# Altium schematic sheet ISO-ASS[3]-VB.SchDoc
size 1200 x 400 mm
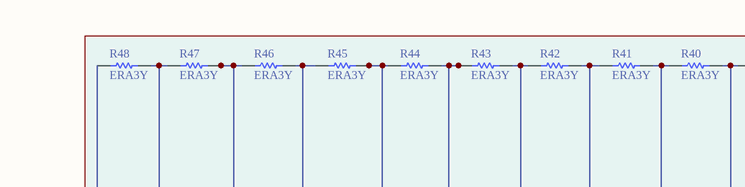
[diagram p0: ISO-ASS[3]-VB.SchDoc, top middle]
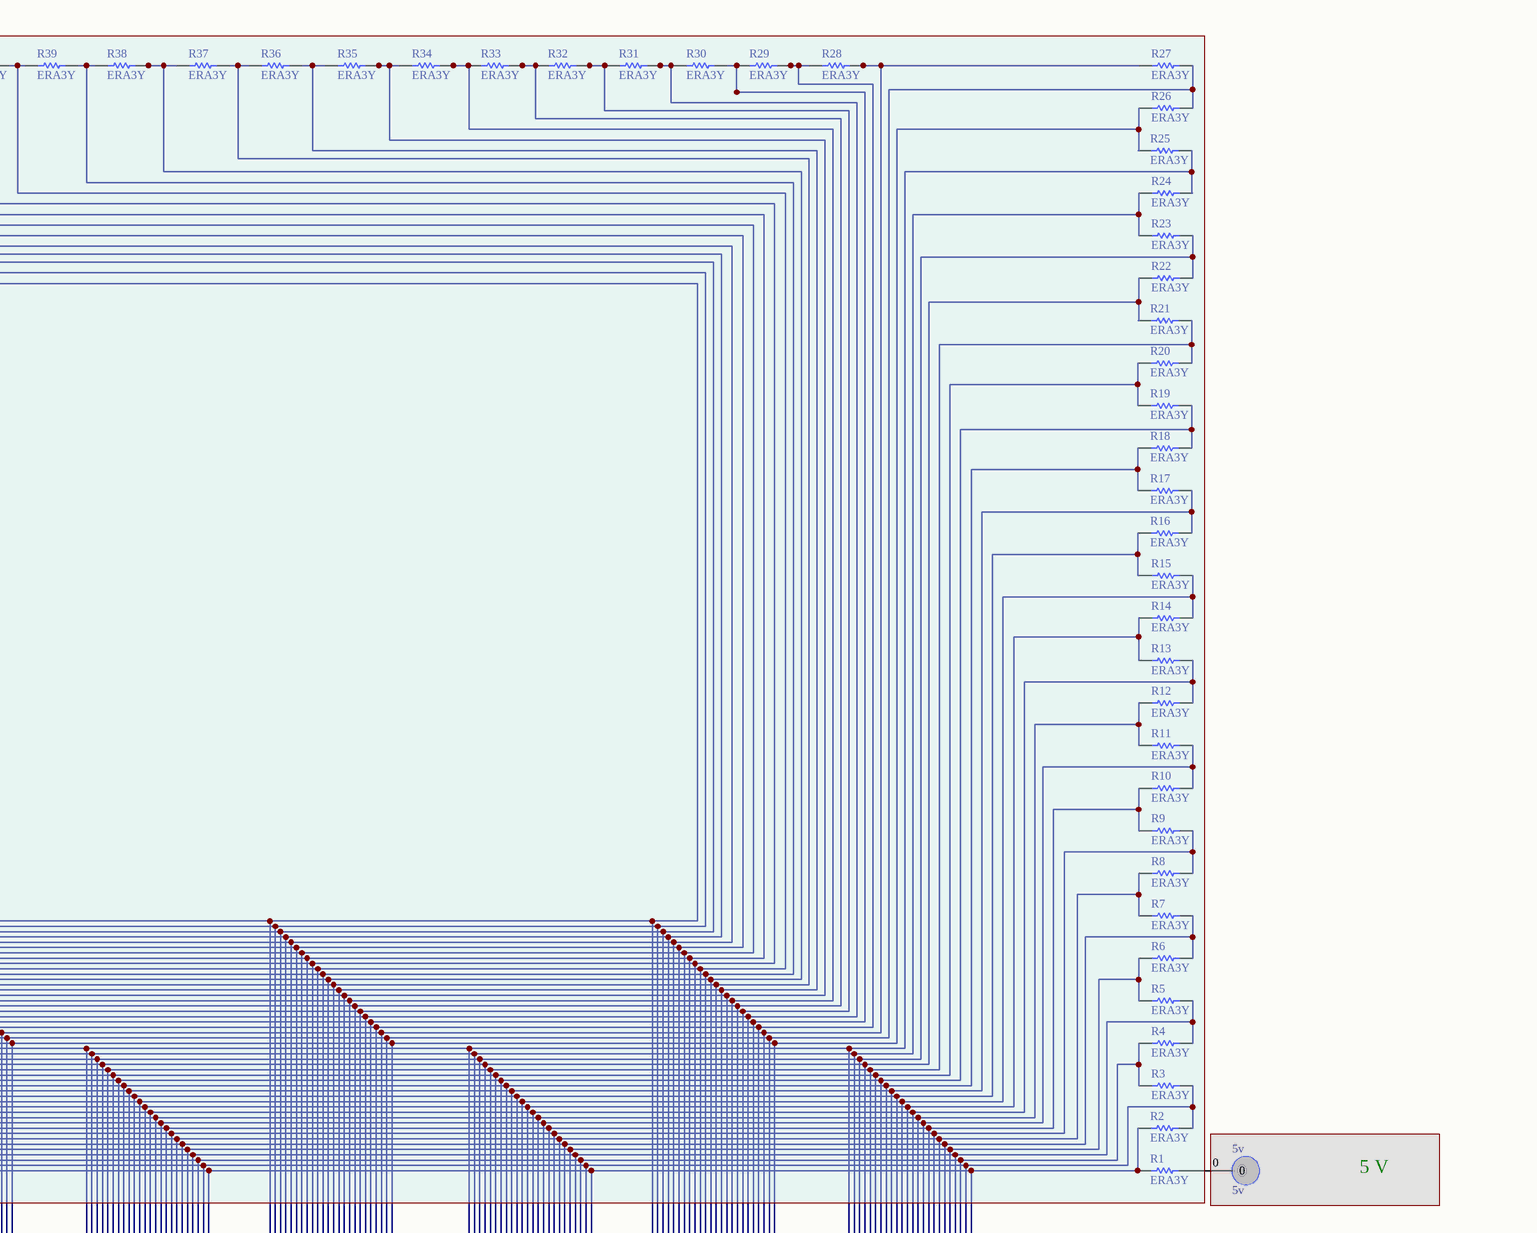
[diagram p1: ISO-ASS[3]-VB.SchDoc, top right]
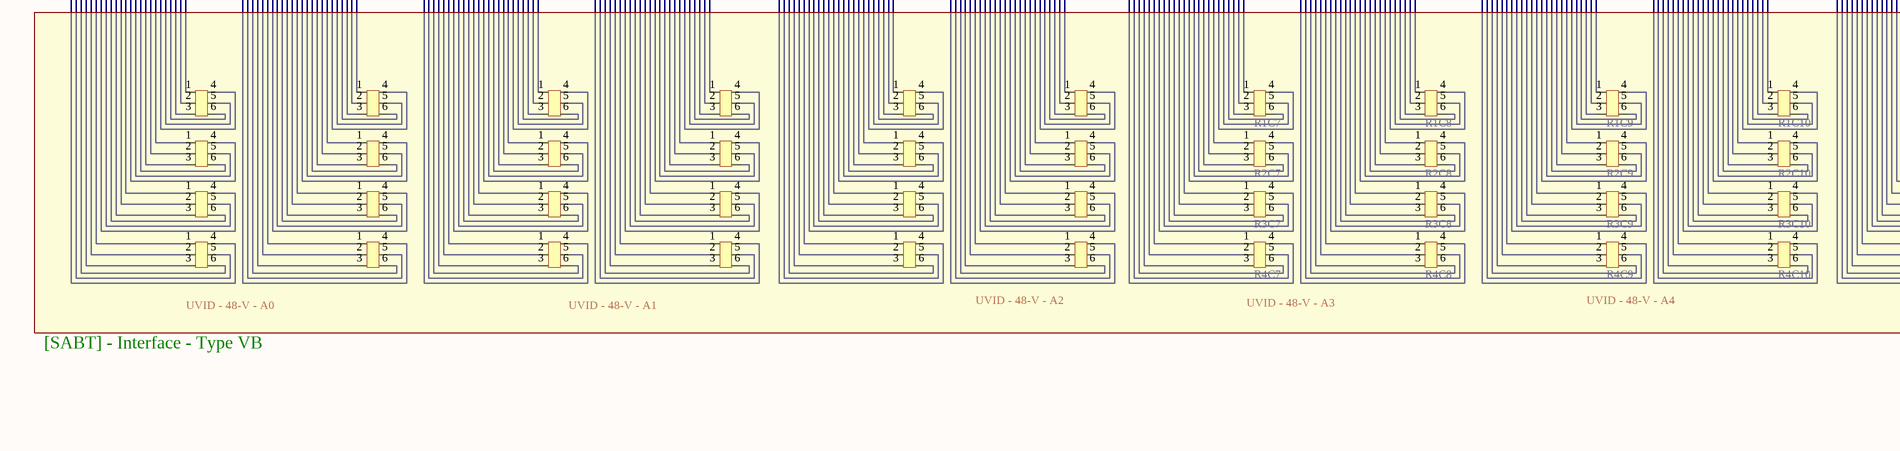
[diagram p2: ISO-ASS[3]-VB.SchDoc, bottom left]
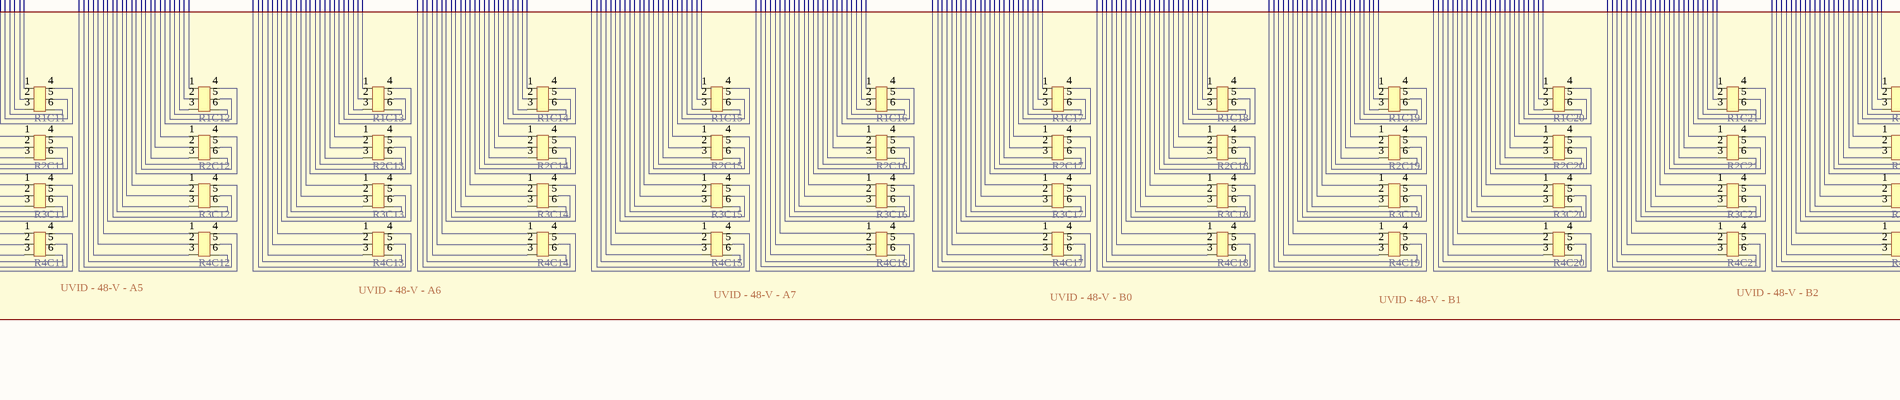
[diagram p3: ISO-ASS[3]-VB.SchDoc, bottom middle]
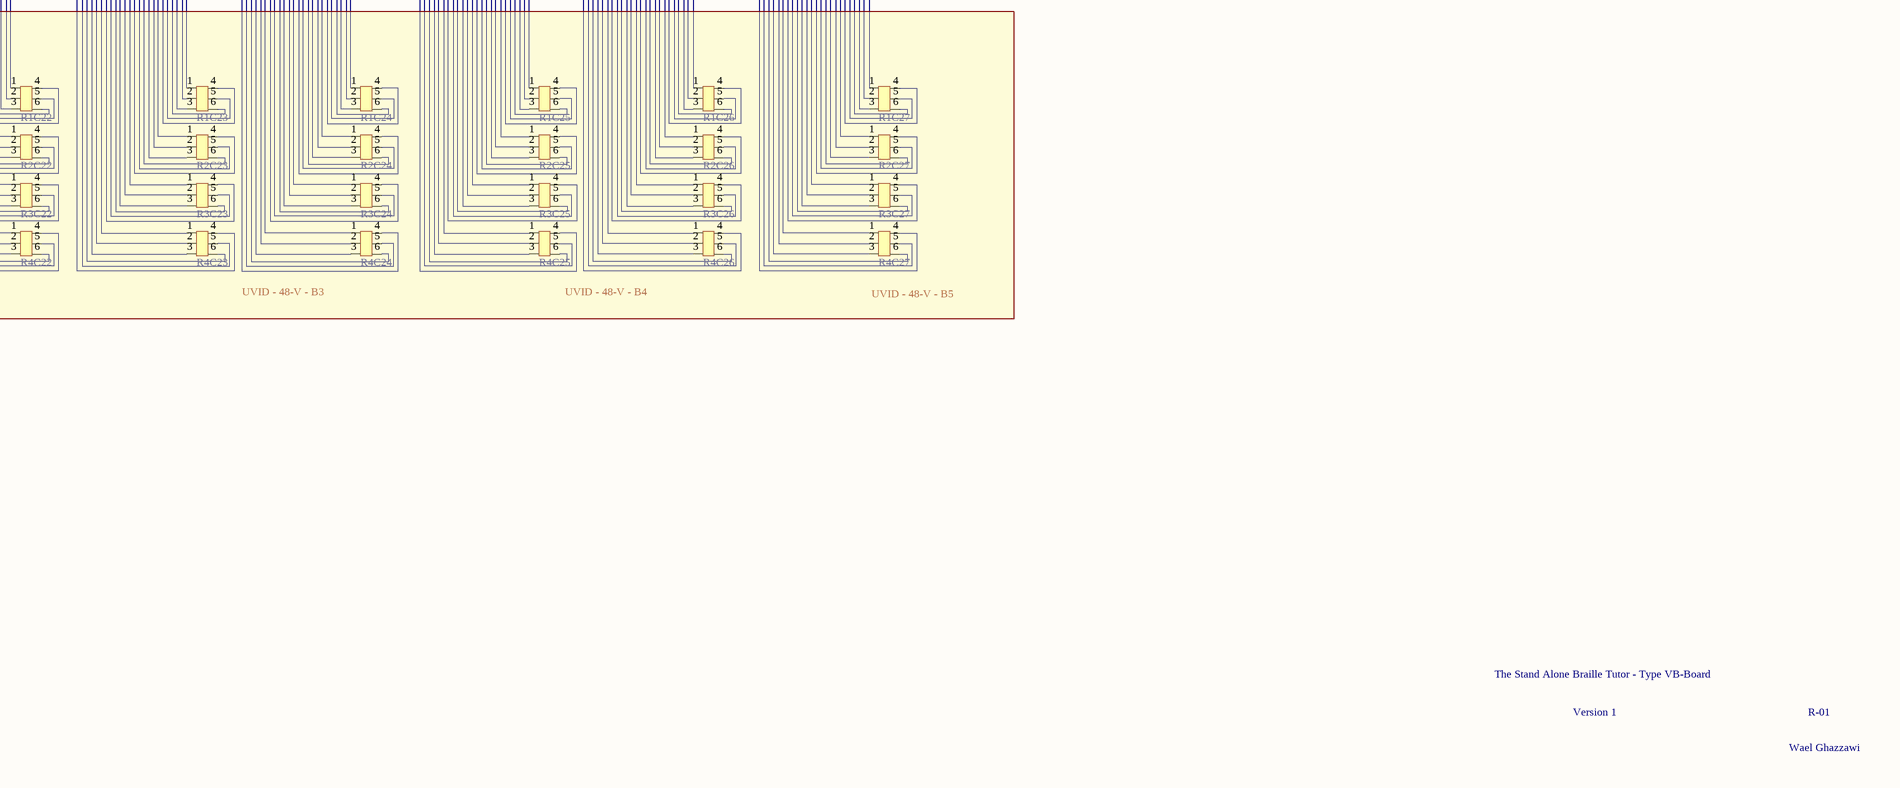
[diagram p4: ISO-ASS[3]-VB.SchDoc, bottom right]

## Parts
5v  5v  [5v]
R1  ERA3Y  [ERA-0603]
R1C1  BC-ASS[3]  [BC-ASS[3]]  (value not drawn)
R1C2  BC-ASS[3]  [BC-ASS[3]]  (value not drawn)
R1C3  BC-ASS[3]  [BC-ASS[3]]  (value not drawn)
R1C4  BC-ASS[3]  [BC-ASS[3]]  (value not drawn)
R1C5  BC-ASS[3]  [BC-ASS[3]]  (value not drawn)
R1C6  BC-ASS[3]  [BC-ASS[3]]  (value not drawn)
R1C7  BC-ASS[3]  [BC-ASS[3]]  (value not drawn)
R1C8  BC-ASS[3]  [BC-ASS[3]]  (value not drawn)
R1C9  BC-ASS[3]  [BC-ASS[3]]  (value not drawn)
R1C10  BC-ASS[3]  [BC-ASS[3]]  (value not drawn)
R1C11  BC-ASS[3]  [BC-ASS[3]]  (value not drawn)
R1C12  BC-ASS[3]  [BC-ASS[3]]  (value not drawn)
R1C13  BC-ASS[3]  [BC-ASS[3]]  (value not drawn)
R1C14  BC-ASS[3]  [BC-ASS[3]]  (value not drawn)
R1C15  BC-ASS[3]  [BC-ASS[3]]  (value not drawn)
R1C16  BC-ASS[3]  [BC-ASS[3]]  (value not drawn)
R1C17  BC-ASS[3]  [BC-ASS[3]]  (value not drawn)
R1C18  BC-ASS[3]  [BC-ASS[3]]  (value not drawn)
R1C19  BC-ASS[3]  [BC-ASS[3]]  (value not drawn)
R1C20  BC-ASS[3]  [BC-ASS[3]]  (value not drawn)
R1C21  BC-ASS[3]  [BC-ASS[3]]  (value not drawn)
R1C22  BC-ASS[3]  [BC-ASS[3]]  (value not drawn)
R1C23  BC-ASS[3]  [BC-ASS[3]]  (value not drawn)
R1C24  BC-ASS[3]  [BC-ASS[3]]  (value not drawn)
R1C25  BC-ASS[3]  [BC-ASS[3]]  (value not drawn)
R1C26  BC-ASS[3]  [BC-ASS[3]]  (value not drawn)
R1C27  BC-ASS[3]  [BC-ASS[3]]  (value not drawn)
R2  ERA3Y  [ERA-0603]
R2C1  BC-ASS[3]  [BC-ASS[3]]  (value not drawn)
R2C2  BC-ASS[3]  [BC-ASS[3]]  (value not drawn)
R2C3  BC-ASS[3]  [BC-ASS[3]]  (value not drawn)
R2C4  BC-ASS[3]  [BC-ASS[3]]  (value not drawn)
R2C5  BC-ASS[3]  [BC-ASS[3]]  (value not drawn)
R2C6  BC-ASS[3]  [BC-ASS[3]]  (value not drawn)
R2C7  BC-ASS[3]  [BC-ASS[3]]  (value not drawn)
R2C8  BC-ASS[3]  [BC-ASS[3]]  (value not drawn)
R2C9  BC-ASS[3]  [BC-ASS[3]]  (value not drawn)
R2C10  BC-ASS[3]  [BC-ASS[3]]  (value not drawn)
R2C11  BC-ASS[3]  [BC-ASS[3]]  (value not drawn)
R2C12  BC-ASS[3]  [BC-ASS[3]]  (value not drawn)
R2C13  BC-ASS[3]  [BC-ASS[3]]  (value not drawn)
R2C14  BC-ASS[3]  [BC-ASS[3]]  (value not drawn)
R2C15  BC-ASS[3]  [BC-ASS[3]]  (value not drawn)
R2C16  BC-ASS[3]  [BC-ASS[3]]  (value not drawn)
R2C17  BC-ASS[3]  [BC-ASS[3]]  (value not drawn)
R2C18  BC-ASS[3]  [BC-ASS[3]]  (value not drawn)
R2C19  BC-ASS[3]  [BC-ASS[3]]  (value not drawn)
R2C20  BC-ASS[3]  [BC-ASS[3]]  (value not drawn)
R2C21  BC-ASS[3]  [BC-ASS[3]]  (value not drawn)
R2C22  BC-ASS[3]  [BC-ASS[3]]  (value not drawn)
R2C23  BC-ASS[3]  [BC-ASS[3]]  (value not drawn)
R2C24  BC-ASS[3]  [BC-ASS[3]]  (value not drawn)
R2C25  BC-ASS[3]  [BC-ASS[3]]  (value not drawn)
R2C26  BC-ASS[3]  [BC-ASS[3]]  (value not drawn)
R2C27  BC-ASS[3]  [BC-ASS[3]]  (value not drawn)
R3  ERA3Y  [ERA-0603]
R3C1  BC-ASS[3]  [BC-ASS[3]]  (value not drawn)
R3C2  BC-ASS[3]  [BC-ASS[3]]  (value not drawn)
R3C3  BC-ASS[3]  [BC-ASS[3]]  (value not drawn)
R3C4  BC-ASS[3]  [BC-ASS[3]]  (value not drawn)
R3C5  BC-ASS[3]  [BC-ASS[3]]  (value not drawn)
R3C6  BC-ASS[3]  [BC-ASS[3]]  (value not drawn)
R3C7  BC-ASS[3]  [BC-ASS[3]]  (value not drawn)
R3C8  BC-ASS[3]  [BC-ASS[3]]  (value not drawn)
R3C9  BC-ASS[3]  [BC-ASS[3]]  (value not drawn)
R3C10  BC-ASS[3]  [BC-ASS[3]]  (value not drawn)
R3C11  BC-ASS[3]  [BC-ASS[3]]  (value not drawn)
R3C12  BC-ASS[3]  [BC-ASS[3]]  (value not drawn)
R3C13  BC-ASS[3]  [BC-ASS[3]]  (value not drawn)
R3C14  BC-ASS[3]  [BC-ASS[3]]  (value not drawn)
R3C15  BC-ASS[3]  [BC-ASS[3]]  (value not drawn)
R3C16  BC-ASS[3]  [BC-ASS[3]]  (value not drawn)
R3C17  BC-ASS[3]  [BC-ASS[3]]  (value not drawn)
R3C18  BC-ASS[3]  [BC-ASS[3]]  (value not drawn)
R3C19  BC-ASS[3]  [BC-ASS[3]]  (value not drawn)
R3C20  BC-ASS[3]  [BC-ASS[3]]  (value not drawn)
R3C21  BC-ASS[3]  [BC-ASS[3]]  (value not drawn)
R3C22  BC-ASS[3]  [BC-ASS[3]]  (value not drawn)
R3C23  BC-ASS[3]  [BC-ASS[3]]  (value not drawn)
R3C24  BC-ASS[3]  [BC-ASS[3]]  (value not drawn)
R3C25  BC-ASS[3]  [BC-ASS[3]]  (value not drawn)
R3C26  BC-ASS[3]  [BC-ASS[3]]  (value not drawn)
R3C27  BC-ASS[3]  [BC-ASS[3]]  (value not drawn)
R4  ERA3Y  [ERA-0603]
R4C1  BC-ASS[3]  [BC-ASS[3]]  (value not drawn)
R4C2  BC-ASS[3]  [BC-ASS[3]]  (value not drawn)
R4C3  BC-ASS[3]  [BC-ASS[3]]  (value not drawn)
R4C4  BC-ASS[3]  [BC-ASS[3]]  (value not drawn)
R4C5  BC-ASS[3]  [BC-ASS[3]]  (value not drawn)
R4C6  BC-ASS[3]  [BC-ASS[3]]  (value not drawn)
R4C7  BC-ASS[3]  [BC-ASS[3]]  (value not drawn)
R4C8  BC-ASS[3]  [BC-ASS[3]]  (value not drawn)
R4C9  BC-ASS[3]  [BC-ASS[3]]  (value not drawn)
R4C10  BC-ASS[3]  [BC-ASS[3]]  (value not drawn)
R4C11  BC-ASS[3]  [BC-ASS[3]]  (value not drawn)
R4C12  BC-ASS[3]  [BC-ASS[3]]  (value not drawn)
R4C13  BC-ASS[3]  [BC-ASS[3]]  (value not drawn)
R4C14  BC-ASS[3]  [BC-ASS[3]]  (value not drawn)
R4C15  BC-ASS[3]  [BC-ASS[3]]  (value not drawn)
R4C16  BC-ASS[3]  [BC-ASS[3]]  (value not drawn)
R4C17  BC-ASS[3]  [BC-ASS[3]]  (value not drawn)
R4C18  BC-ASS[3]  [BC-ASS[3]]  (value not drawn)
R4C19  BC-ASS[3]  [BC-ASS[3]]  (value not drawn)
R4C20  BC-ASS[3]  [BC-ASS[3]]  (value not drawn)
R4C21  BC-ASS[3]  [BC-ASS[3]]  (value not drawn)
R4C22  BC-ASS[3]  [BC-ASS[3]]  (value not drawn)
R4C23  BC-ASS[3]  [BC-ASS[3]]  (value not drawn)
R4C24  BC-ASS[3]  [BC-ASS[3]]  (value not drawn)
R4C25  BC-ASS[3]  [BC-ASS[3]]  (value not drawn)
R4C26  BC-ASS[3]  [BC-ASS[3]]  (value not drawn)
R4C27  BC-ASS[3]  [BC-ASS[3]]  (value not drawn)
R5  ERA3Y  [ERA-0603]
R6  ERA3Y  [ERA-0603]
R7  ERA3Y  [ERA-0603]
R8  ERA3Y  [ERA-0603]
R9  ERA3Y  [ERA-0603]
R10  ERA3Y  [ERA-0603]
R11  ERA3Y  [ERA-0603]
R12  ERA3Y  [ERA-0603]
R13  ERA3Y  [ERA-0603]
R14  ERA3Y  [ERA-0603]
R15  ERA3Y  [ERA-0603]
R16  ERA3Y  [ERA-0603]
R17  ERA3Y  [ERA-0603]
R18  ERA3Y  [ERA-0603]
R19  ERA3Y  [ERA-0603]
R20  ERA3Y  [ERA-0603]
R21  ERA3Y  [ERA-0603]
R22  ERA3Y  [ERA-0603]
R23  ERA3Y  [ERA-0603]
R24  ERA3Y  [ERA-0603]
R25  ERA3Y  [ERA-0603]
R26  ERA3Y  [ERA-0603]
R27  ERA3Y  [ERA-0603]
R28  ERA3Y  [ERA-0603]
R29  ERA3Y  [ERA-0603]
R30  ERA3Y  [ERA-0603]
R31  ERA3Y  [ERA-0603]
R32  ERA3Y  [ERA-0603]
R33  ERA3Y  [ERA-0603]
R34  ERA3Y  [ERA-0603]
R35  ERA3Y  [ERA-0603]
R36  ERA3Y  [ERA-0603]
R37  ERA3Y  [ERA-0603]
R38  ERA3Y  [ERA-0603]
R39  ERA3Y  [ERA-0603]
R40  ERA3Y  [ERA-0603]
R41  ERA3Y  [ERA-0603]
R42  ERA3Y  [ERA-0603]
R43  ERA3Y  [ERA-0603]
R44  ERA3Y  [ERA-0603]
R45  ERA3Y  [ERA-0603]
R46  ERA3Y  [ERA-0603]
R47  ERA3Y  [ERA-0603]
R48  ERA3Y  [ERA-0603]

## Blocks framed on the sheet
5 V: 5v

## Nets
Net5v_0: 5v.0 R1.2
NetR1_1: R1.1 R1C1.1 R1C3.1 R1C5.1 R1C7.1 R1C9.1 R1C11.1 R1C13.1 R1C15.1 R1C17.1 R1C19.1 R1C21.1 R1C23.1 R1C25.1 R1C27.1 R2.1
NetR1C1_2: R1C1.2 R1C3.2 R1C5.2 R1C7.2 R1C9.2 R1C11.2 R1C13.2 R1C15.2 R1C17.2 R1C19.2 R1C21.2 R1C23.2 R1C25.2 R1C27.2 R2.2 R3.2
NetR1C1_3: R1C1.3 R1C3.3 R1C5.3 R1C7.3 R1C9.3 R1C11.3 R1C13.3 R1C15.3 R1C17.3 R1C19.3 R1C21.3 R1C23.3 R1C25.3 R1C27.3 R3.1 R4.1
NetR1C1_4: R1C1.4 R1C3.4 R1C5.4 R1C7.4 R1C9.4 R1C11.4 R1C13.4 R1C15.4 R1C17.4 R1C19.4 R1C21.4 R1C23.4 R1C25.4 R1C27.4 R6.2 R7.2
NetR1C1_5: R1C1.5 R1C3.5 R1C5.5 R1C7.5 R1C9.5 R1C11.5 R1C13.5 R1C15.5 R1C17.5 R1C19.5 R1C21.5 R1C23.5 R1C25.5 R1C27.5 R5.1 R6.1
NetR1C1_6: R1C1.6 R1C3.6 R1C5.6 R1C7.6 R1C9.6 R1C11.6 R1C13.6 R1C15.6 R1C17.6 R1C19.6 R1C21.6 R1C23.6 R1C25.6 R1C27.6 R4.2 R5.2
NetR1C2_1: R1C2.1 R1C4.1 R1C6.1 R1C8.1 R1C10.1 R1C12.1 R1C14.1 R1C16.1 R1C18.1 R1C20.1 R1C22.1 R1C24.1 R1C26.1 R25.1 R26.1
NetR1C2_2: R1C2.2 R1C4.2 R1C6.2 R1C8.2 R1C10.2 R1C12.2 R1C14.2 R1C16.2 R1C18.2 R1C20.2 R1C22.2 R1C24.2 R1C26.2 R26.2 R27.2
NetR1C2_3: R1C2.3 R1C4.3 R1C6.3 R1C8.3 R1C10.3 R1C12.3 R1C14.3 R1C16.3 R1C18.3 R1C20.3 R1C22.3 R1C24.3 R1C26.3 R27.1 R28.2
NetR1C2_4: R1C2.4 R1C4.4 R1C6.4 R1C8.4 R1C10.4 R1C12.4 R1C14.4 R1C16.4 R1C18.4 R1C20.4 R1C22.4 R1C24.4 R1C26.4 R30.1 R31.2
NetR1C2_5: R1C2.5 R1C4.5 R1C6.5 R1C8.5 R1C10.5 R1C12.5 R1C14.5 R1C16.5 R1C18.5 R1C20.5 R1C22.5 R1C24.5 R1C26.5 R29.1 R30.2
NetR1C2_6: R1C2.6 R1C4.6 R1C6.6 R1C8.6 R1C10.6 R1C12.6 R1C14.6 R1C16.6 R1C18.6 R1C20.6 R1C22.6 R1C24.6 R1C26.6 R28.1 R29.2
NetR2C1_1: R2C1.1 R2C3.1 R2C5.1 R2C7.1 R2C9.1 R2C11.1 R2C13.1 R2C15.1 R2C17.1 R2C19.1 R2C21.1 R2C23.1 R2C25.1 R2C27.1 R7.1 R8.1
NetR2C1_2: R2C1.2 R2C3.2 R2C5.2 R2C7.2 R2C9.2 R2C11.2 R2C13.2 R2C15.2 R2C17.2 R2C19.2 R2C21.2 R2C23.2 R2C25.2 R2C27.2 R8.2 R9.2
NetR2C1_3: R2C1.3 R2C3.3 R2C5.3 R2C7.3 R2C9.3 R2C11.3 R2C13.3 R2C15.3 R2C17.3 R2C19.3 R2C21.3 R2C23.3 R2C25.3 R2C27.3 R9.1 R10.1
NetR2C1_4: R2C1.4 R2C3.4 R2C5.4 R2C7.4 R2C9.4 R2C11.4 R2C13.4 R2C15.4 R2C17.4 R2C19.4 R2C21.4 R2C23.4 R2C25.4 R2C27.4 R12.2 R13.2
NetR2C1_5: R2C1.5 R2C3.5 R2C5.5 R2C7.5 R2C9.5 R2C11.5 R2C13.5 R2C15.5 R2C17.5 R2C19.5 R2C21.5 R2C23.5 R2C25.5 R2C27.5 R11.1 R12.1
NetR2C1_6: R2C1.6 R2C3.6 R2C5.6 R2C7.6 R2C9.6 R2C11.6 R2C13.6 R2C15.6 R2C17.6 R2C19.6 R2C21.6 R2C23.6 R2C25.6 R2C27.6 R10.2 R11.2
NetR2C2_1: R2C2.1 R2C4.1 R2C6.1 R2C8.1 R2C10.1 R2C12.1 R2C14.1 R2C16.1 R2C18.1 R2C20.1 R2C22.1 R2C24.1 R2C26.1 R31.1 R32.2
NetR2C2_2: R2C2.2 R2C4.2 R2C6.2 R2C8.2 R2C10.2 R2C12.2 R2C14.2 R2C16.2 R2C18.2 R2C20.2 R2C22.2 R2C24.2 R2C26.2 R32.1 R33.2
NetR2C2_3: R2C2.3 R2C4.3 R2C6.3 R2C8.3 R2C10.3 R2C12.3 R2C14.3 R2C16.3 R2C18.3 R2C20.3 R2C22.3 R2C24.3 R2C26.3 R33.1 R34.2
NetR2C2_4: R2C2.4 R2C4.4 R2C6.4 R2C8.4 R2C10.4 R2C12.4 R2C14.4 R2C16.4 R2C18.4 R2C20.4 R2C22.4 R2C24.4 R2C26.4 R36.1 R37.2
NetR2C2_5: R2C2.5 R2C4.5 R2C6.5 R2C8.5 R2C10.5 R2C12.5 R2C14.5 R2C16.5 R2C18.5 R2C20.5 R2C22.5 R2C24.5 R2C26.5 R35.1 R36.2
NetR2C2_6: R2C2.6 R2C4.6 R2C6.6 R2C8.6 R2C10.6 R2C12.6 R2C14.6 R2C16.6 R2C18.6 R2C20.6 R2C22.6 R2C24.6 R2C26.6 R34.1 R35.2
NetR3C1_1: R3C1.1 R3C3.1 R3C5.1 R3C7.1 R3C9.1 R3C11.1 R3C13.1 R3C15.1 R3C17.1 R3C19.1 R3C21.1 R3C23.1 R3C25.1 R3C27.1 R13.1 R14.1
NetR3C1_2: R3C1.2 R3C3.2 R3C5.2 R3C7.2 R3C9.2 R3C11.2 R3C13.2 R3C15.2 R3C17.2 R3C19.2 R3C21.2 R3C23.2 R3C25.2 R3C27.2 R14.2 R15.2
NetR3C1_3: R3C1.3 R3C3.3 R3C5.3 R3C7.3 R3C9.3 R3C11.3 R3C13.3 R3C15.3 R3C17.3 R3C19.3 R3C21.3 R3C23.3 R3C25.3 R3C27.3 R15.1 R16.1
NetR3C1_4: R3C1.4 R3C3.4 R3C5.4 R3C7.4 R3C9.4 R3C11.4 R3C13.4 R3C15.4 R3C17.4 R3C19.4 R3C21.4 R3C23.4 R3C25.4 R3C27.4 R18.2 R19.2
NetR3C1_5: R3C1.5 R3C3.5 R3C5.5 R3C7.5 R3C9.5 R3C11.5 R3C13.5 R3C15.5 R3C17.5 R3C19.5 R3C21.5 R3C23.5 R3C25.5 R3C27.5 R17.1 R18.1
NetR3C1_6: R3C1.6 R3C3.6 R3C5.6 R3C7.6 R3C9.6 R3C11.6 R3C13.6 R3C15.6 R3C17.6 R3C19.6 R3C21.6 R3C23.6 R3C25.6 R3C27.6 R16.2 R17.2
NetR3C2_1: R3C2.1 R3C4.1 R3C6.1 R3C8.1 R3C10.1 R3C12.1 R3C14.1 R3C16.1 R3C18.1 R3C20.1 R3C22.1 R3C24.1 R3C26.1 R37.1 R38.2
NetR3C2_2: R3C2.2 R3C4.2 R3C6.2 R3C8.2 R3C10.2 R3C12.2 R3C14.2 R3C16.2 R3C18.2 R3C20.2 R3C22.2 R3C24.2 R3C26.2 R38.1 R39.2
NetR3C2_3: R3C2.3 R3C4.3 R3C6.3 R3C8.3 R3C10.3 R3C12.3 R3C14.3 R3C16.3 R3C18.3 R3C20.3 R3C22.3 R3C24.3 R3C26.3 R39.1 R40.2
NetR3C2_4: R3C2.4 R3C4.4 R3C6.4 R3C8.4 R3C10.4 R3C12.4 R3C14.4 R3C16.4 R3C18.4 R3C20.4 R3C22.4 R3C24.4 R3C26.4 R42.1 R43.2
NetR3C2_5: R3C2.5 R3C4.5 R3C6.5 R3C8.5 R3C10.5 R3C12.5 R3C14.5 R3C16.5 R3C18.5 R3C20.5 R3C22.5 R3C24.5 R3C26.5 R41.1 R42.2
NetR3C2_6: R3C2.6 R3C4.6 R3C6.6 R3C8.6 R3C10.6 R3C12.6 R3C14.6 R3C16.6 R3C18.6 R3C20.6 R3C22.6 R3C24.6 R3C26.6 R40.1 R41.2
NetR4C1_1: R4C1.1 R4C3.1 R4C5.1 R4C7.1 R4C9.1 R4C11.1 R4C13.1 R4C15.1 R4C17.1 R4C19.1 R4C21.1 R4C23.1 R4C25.1 R4C27.1 R19.1 R20.1
NetR4C1_2: R4C1.2 R4C3.2 R4C5.2 R4C7.2 R4C9.2 R4C11.2 R4C13.2 R4C15.2 R4C17.2 R4C19.2 R4C21.2 R4C23.2 R4C25.2 R4C27.2 R20.2 R21.2
NetR4C1_3: R4C1.3 R4C3.3 R4C5.3 R4C7.3 R4C9.3 R4C11.3 R4C13.3 R4C15.3 R4C17.3 R4C19.3 R4C21.3 R4C23.3 R4C25.3 R4C27.3 R21.1 R22.1
NetR4C1_4: R4C1.4 R4C3.4 R4C5.4 R4C7.4 R4C9.4 R4C11.4 R4C13.4 R4C15.4 R4C17.4 R4C19.4 R4C21.4 R4C23.4 R4C25.4 R4C27.4 R24.2 R25.2
NetR4C1_5: R4C1.5 R4C3.5 R4C5.5 R4C7.5 R4C9.5 R4C11.5 R4C13.5 R4C15.5 R4C17.5 R4C19.5 R4C21.5 R4C23.5 R4C25.5 R4C27.5 R23.1 R24.1
NetR4C1_6: R4C1.6 R4C3.6 R4C5.6 R4C7.6 R4C9.6 R4C11.6 R4C13.6 R4C15.6 R4C17.6 R4C19.6 R4C21.6 R4C23.6 R4C25.6 R4C27.6 R22.2 R23.2
NetR4C2_1: R4C2.1 R4C4.1 R4C6.1 R4C8.1 R4C10.1 R4C12.1 R4C14.1 R4C16.1 R4C18.1 R4C20.1 R4C22.1 R4C24.1 R4C26.1 R43.1 R44.2
NetR4C2_2: R4C2.2 R4C4.2 R4C6.2 R4C8.2 R4C10.2 R4C12.2 R4C14.2 R4C16.2 R4C18.2 R4C20.2 R4C22.2 R4C24.2 R4C26.2 R44.1 R45.2
NetR4C2_3: R4C2.3 R4C4.3 R4C6.3 R4C8.3 R4C10.3 R4C12.3 R4C14.3 R4C16.3 R4C18.3 R4C20.3 R4C22.3 R4C24.3 R4C26.3 R45.1 R46.2
NetR4C2_4: R4C2.4 R4C4.4 R4C6.4 R4C8.4 R4C10.4 R4C12.4 R4C14.4 R4C16.4 R4C18.4 R4C20.4 R4C22.4 R4C24.4 R4C26.4 R48.1
NetR4C2_5: R4C2.5 R4C4.5 R4C6.5 R4C8.5 R4C10.5 R4C12.5 R4C14.5 R4C16.5 R4C18.5 R4C20.5 R4C22.5 R4C24.5 R4C26.5 R47.1 R48.2
NetR4C2_6: R4C2.6 R4C4.6 R4C6.6 R4C8.6 R4C10.6 R4C12.6 R4C14.6 R4C16.6 R4C18.6 R4C20.6 R4C22.6 R4C24.6 R4C26.6 R46.1 R47.2

## Notes on the sheet
- [SABT] - Interface - Type VB
- The Stand Alone Braille Tutor - Type VB-Board
- Version 1
- R-01
- Wael Ghazzawi
- Labels drawn without touching a wire or pin: UVID - 48-V - A0, UVID - 48-V - A1, UVID - 48-V - A2, UVID - 48-V - A3, UVID - 48-V - A4, UVID - 48-V - A5, UVID - 48-V - A6, UVID - 48-V - A7, UVID - 48-V - B0, UVID - 48-V - B1, UVID - 48-V - B2, UVID - 48-V - B3, UVID - 48-V - B4, UVID - 48-V - B5

## Library data of the parts
R1-R48 = ERA3Y: Rectangular Thick Film Chip Resistor, 10 Ohm to 330k Ohm Range, 0.1% and 0.5% Tolerance, 0603 Size, 0.063 W; Note: If flow soldering, adjust pad width of PCB Footprint to 0.7 - 0.8 times the width of the resistor.; Published: 17-Dec-2003; LatestRevisionDate: 19-Mar-2004; LatestRevisionNote: Silkscreen size reduced.; PackageDocument: Mar-2003; PackageReference: ERA-0603; Publisher: Altium Limited; Code_IPC: 1608 [0603]; ComponentLink1Description: Manufacturer Link; ComponentLink1URL: http://www.panasonic.com/industrial/components/resistive_products.htm; ComponentLink2Description: Datasheet; ComponentLink2URL: http://www.panasonic.com/industrial/components/pdf/AOA0000CE8.pdf